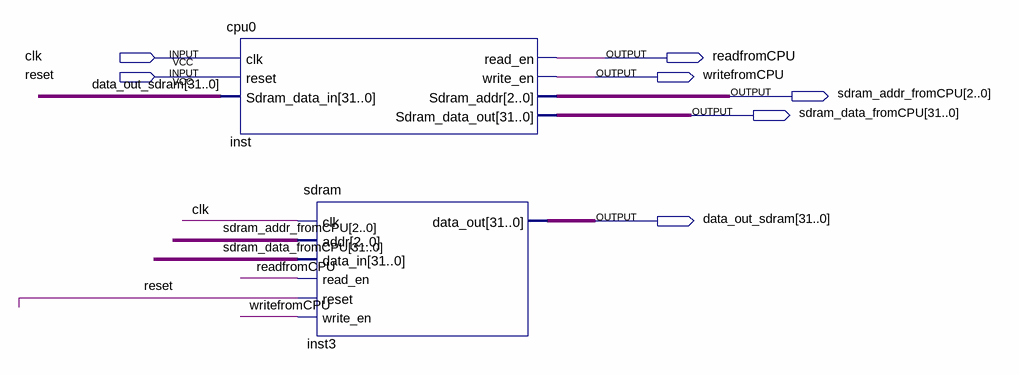
[diagram p0: schematic sheet]
// Quartus schematic TransactionsBetweenCPU.bdf as structural Verilog: 2 symbols, 7 pins
module TransactionsBetweenCPU (
  input  clk,
  input  reset,
  output readfromCPU,
  output writefromCPU,
  output [2:0] sdram_addr_fromCPU,
  output [31:0] sdram_data_fromCPU,
  output [31:0] data_out_sdram
);

  cpu0 inst (
    .clk(clk), .reset(reset), .Sdram_data_in(data_out_sdram), .read_en(readfromCPU), .write_en(writefromCPU),
    .Sdram_addr(sdram_addr_fromCPU), .Sdram_data_out(sdram_data_fromCPU));
  sdram inst3 (
    .clk(clk), .addr(sdram_addr_fromCPU), .data_in(sdram_data_fromCPU), .read_en(readfromCPU), .reset(reset),
    .write_en(writefromCPU), .data_out(data_out_sdram));
endmodule
